# Altium schematic sheet Sheet1.SchDoc
size A; SheetNumber: 1; SheetTotal: 1
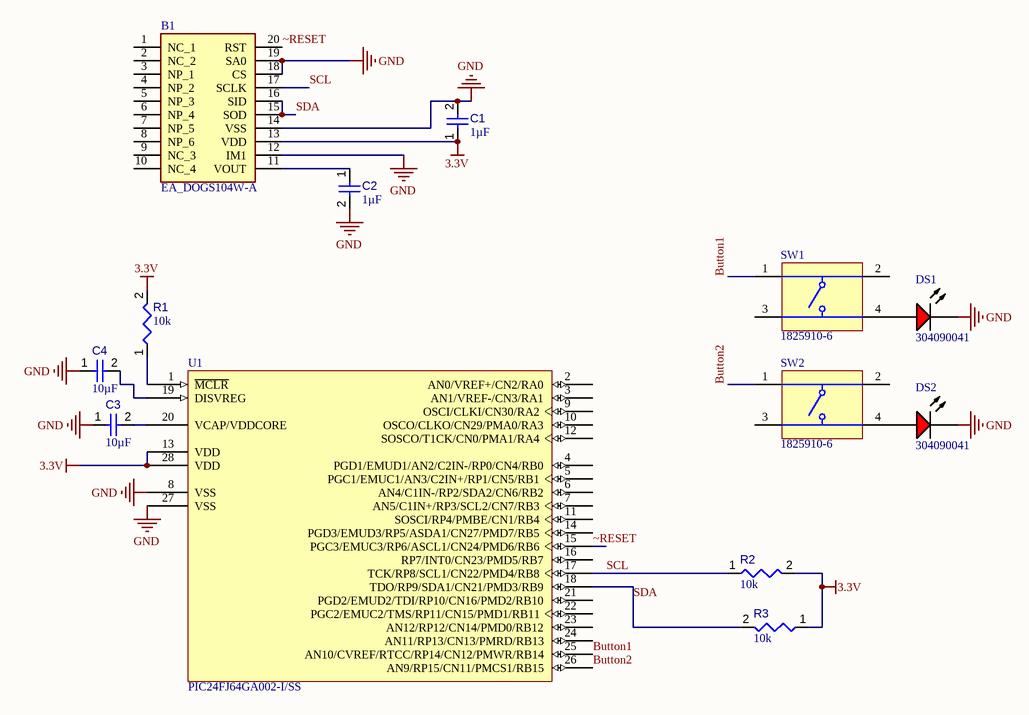
[diagram p0: Sheet1.SchDoc]

## Parts
B1  EA_DOGS104W-A  [DIP2540W50P254L3600H260Q20N]
C1  value 1µF  [CAPC2013X135X45NL10T25]  (hidden comment: Capacitor 1 uF +/- 10% 50 V 0805)
C2  value 1µF  [CAPC2013X135X45NL10T25]  (hidden comment: Capacitor 1 uF +/- 10% 50 V 0805)
C3  value 10µF  [CAPC3216X180X50NL20T25]  (hidden comment: Capacitor 10 uF +/- 10% 16 V 1206)
C4  value 10µF  [CAPC3216X180X50NL20T25]  (hidden comment: Capacitor 10 uF +/- 10% 16 V 1206)
DS1  304090041  [LED-2P-2.28-3MM_A]
DS2  304090041  [LED-2P-2.28-3MM_A]
R1  value 10k  [RESC0402(1005)_L]  (hidden comment: 10KR2F)
R2  value 10k  [RESC0402(1005)_L]  (hidden comment: 10KR2F)
R3  value 10k  [RESC0402(1005)_L]  (hidden comment: 10KR2F)
SW1  1825910-6  [TECO-1825910-6_V]
SW2  1825910-6  [TECO-1825910-6_V]
U1  PIC24FJ64GA002-I/SS  [SSOP-SS28_L]

## Nets
3.3V: B1.13(VDD) C1.1 R1.2 R2.2 R3.1 U1.13(VDD) U1.28(VDD)
GND: B1.12(IM1) B1.14(VSS) B1.18(CS) B1.19(SA0) C1.2 C2.2 C3.1 C4.1 DS1.2(K) DS2.2(K) U1.8(VSS) U1.27(VSS)
Button1: SW1.1 U1.25(AN10/CVREF/RTCC/RP14/CN12/PMWR/RB14)
Button2: SW2.1 U1.26(AN9/RP15/CN11/PMCS1/RB15)
SCL: B1.17(SCLK) R2.1 U1.17(TCK/RP8/SCL1/CN22/PMD4/RB8)
SDA: B1.15(SOD) B1.16(SID) R3.2 U1.18(TDO/RP9/SDA1/CN21/PMD3/RB9)
~RESET: B1.20(RST) U1.15(PGC3/EMUC3/RP6/ASCL1/CN24/PMD6/RB6)
NetB1_11: B1.11(VOUT) C2.1
NetC3_2: C3.2 U1.20(VCAP/VDDCORE)
NetC4_2: C4.2 U1.19(DISVREG)
NetDS1_1: DS1.1(A) SW1.4
NetDS2_1: DS2.1(A) SW2.4
NetR1_1: R1.1 U1.1(~{MCLR})

Not connected (* = marked no-connect by the designer): B1 1(NC_1) 2(NC_2) 3(NP_1) 4(NP_2) 5(NP_3) 6(NP_4) 7(NP_5) 8(NP_6) 9(NC_3) 10(NC_4); SW1 2 3; SW2 2 3; U1 2(AN0/VREF+/CN2/RA0) 3(AN1/VREF-/CN3/RA1) 4(PGD1/EMUD1/AN2/C2IN-/RP0/CN4/RB0) 5(PGC1/EMUC1/AN3/C2IN+/RP1/CN5/RB1) 6(AN4/C1IN-/RP2/SDA2/CN6/RB2) 7(AN5/C1IN+/RP3/SCL2/CN7/RB3) 9(OSCI/CLKI/CN30/RA2) 10(OSCO/CLKO/CN29/PMA0/RA3) 11(SOSCI/RP4/PMBE/CN1/RB4) 12(SOSCO/T1CK/CN0/PMA1/RA4) 14(PGD3/EMUD3/RP5/ASDA1/CN27/PMD7/RB5) 16(RP7/INT0/CN23/PMD5/RB7) 21(PGD2/EMUD2/TDI/RP10/CN16/PMD2/RB10) 22(PGC2/EMUC2/TMS/RP11/CN15/PMD1/RB11) 23(AN12/RP12/CN14/PMD0/RB12) 24(AN11/RP13/CN13/PMRD/RB13)

## Library data of the parts
B1 = EA_DOGS104W-A: LED Backlighting LCD MODULE 4X10 WH BKGRND RFLT 2.6mm; Manufacturer_Name: Display Visions; Manufacturer_Part_Number: EA DOGS104W-A; Mouser Part Number: 790-EADOGS104W-A; Mouser Price/Stock: https://www.mouser.co.uk/ProductDetail/Display-Visions/EA-DOGS104W-A?qs=odmYgEirbwzUir5tR2LWCQ%3D%3D; Datasheet Link: *; Geometry.Height: 2.6mm
C1 C2 = CMP-001-00007-6: Chip Capacitor, 1 uF, +/- 10%, 50 V, 0805 (2012 Metric); Capacitor Type: Ceramic; Voltage Rating: 50V; Min Operating Temperature: -55°C; RoHS Compliant: True; Mounting Technology: SM; Case/Package: 0805; Max Operating Temperature: 125°C; Tolerance: 10%; Pins: 2
C3 C4 = CMP-001-00016-6: Chip Capacitor, 10 uF, +/- 10%, 16 V, 1206 (3216 Metric); Capacitor Type: Ceramic; Voltage Rating: 16V; Tolerance: 10%; Min Operating Temperature: -55°C; Pins: 2; Mounting Technology: SM; Case/Package: 1206; Max Operating Temperature: 125°C; RoHS Compliant: True
DS1 DS2 = CMP-007-00007-2: Red LED, 80 mW, 30 mA, -25 to 85 degC, 2-Pin THD; Manufacturer: Shenzhen CGX; Package Description: 2-Pin Through Hole Device, Dia 3 mm, Pitch 2.28 mm; Datasheet URL: http://datasheet.octopart.com/304090041-Chengguangxing-datasheet-62330656.pdf; Mounting Technology: TH; Manufacturer URL: http://szcgx.com/; RoHS Compliant: Unknown; Datasheet Version: Sep-14; Case/Package: 304090041; Package Reference: 304090041
R1-R3 = CMP-009-00066-2: 10K 0.063W 1% 0402 (1005 Metric)  SMD; Power: 63mW; Case/Package: 0402; Mounting Technology: SMT; Pins: 2; Tolerance: 1%
SW1 SW2 = CMP-1684-00021-1: Tact Switch, SPST-NO, 0.05 A, -35 to 85 degC, 4-Pin THD, RoHS, Bulk; Manufacturer: TE Connectivity; Maximum Contact Resistance: 100mOhm; Mechanical Life: 100000Cycles; Bushing Type: Unthreaded; Switch Configuration: OFF(ON); Maximum DC Voltage Rating: 24V; Contact Rating @ Voltage: 0.05A@24VDC; Actuator Color: Black; Body Orientation: Straight; Function: MomentaryContact; Illumination: N/R; Actuator Style: RoundButton; Actuator Material: PolybutyleneTerephthalate; Dielectric Strength: 500VAC; Pole Throw Configuration: SPST; Actuator Length: 1.4mm; Product Weight: N/A; Contact Material: CopperAlloy; Housing Material: N/A; Terminal Type: PCPins; Minimum Insulation Resistance: 100MOhm; Package Description: 4-Pin Through Hole Device, Body 5.99 x 5.99 mm, Pitch 6.5 mm; Part No: 1825910-6; Package Reference: THD; Base Material: N/A; Manufacturer URL: http://www.te.com; Contact Plating: Silver; RoHS: Yes; Datasheet Version: Rev. C9; Electrical Life: 100000Cycles; Maximum AC Voltage Rating: N/A; Thread Size: N/R; Operating Temperature: -35to85C; Mounting: ThroughHole; Dimension: 5.99x5mm; Datasheet URL: http://www.te.com/commerce/DocumentDelivery/DDEController?Action=showdoc&DocId=Customer+Drawing%7F1825910%7FC9%7Fpdf%7FEnglish%7FENG_CD_1825910_C9.pdf%7F1825910-6; Family: 1825910; Seal Location: N/A; Seal Description: N/A; Packaging: N/A
U1 = CMP-0046-00251-2: General Purpose 16-Bit Flash Microcontroller, 64KB Flash, 8KB SRAM, 28-Pin SSOP, Industrial Temperature; ComponentLink2Description: Packaging Specification; RevisionNote: Component URLs added.; ComponentLink3Description: Microchip.com Home; ComponentLink1Description: Datasheet; PackageVersion: revBB, Aug-2009; PackageDescription: 28-Lead Plastic Shrink Small Outline (SS) - 5.3mm Body [SSOP]; PackageReference: SSOP-SS28; DatasheetVersion: revD, Feb-2010; ComponentLink3URL: http://www.microchip.com/; Code_JEDEC: MS-150; ComponentLink2URL: http://www.microchip.com/stellent/groups/techpub_sg/documents/packagingspec/en012702.pdf; ComponentLink1URL: http://ww1.microchip.com/downloads/en/DeviceDoc/39881D.pdf